# EAGLE design WM8731_STM32F405_Featherwing (EAGLE 9.6.2)
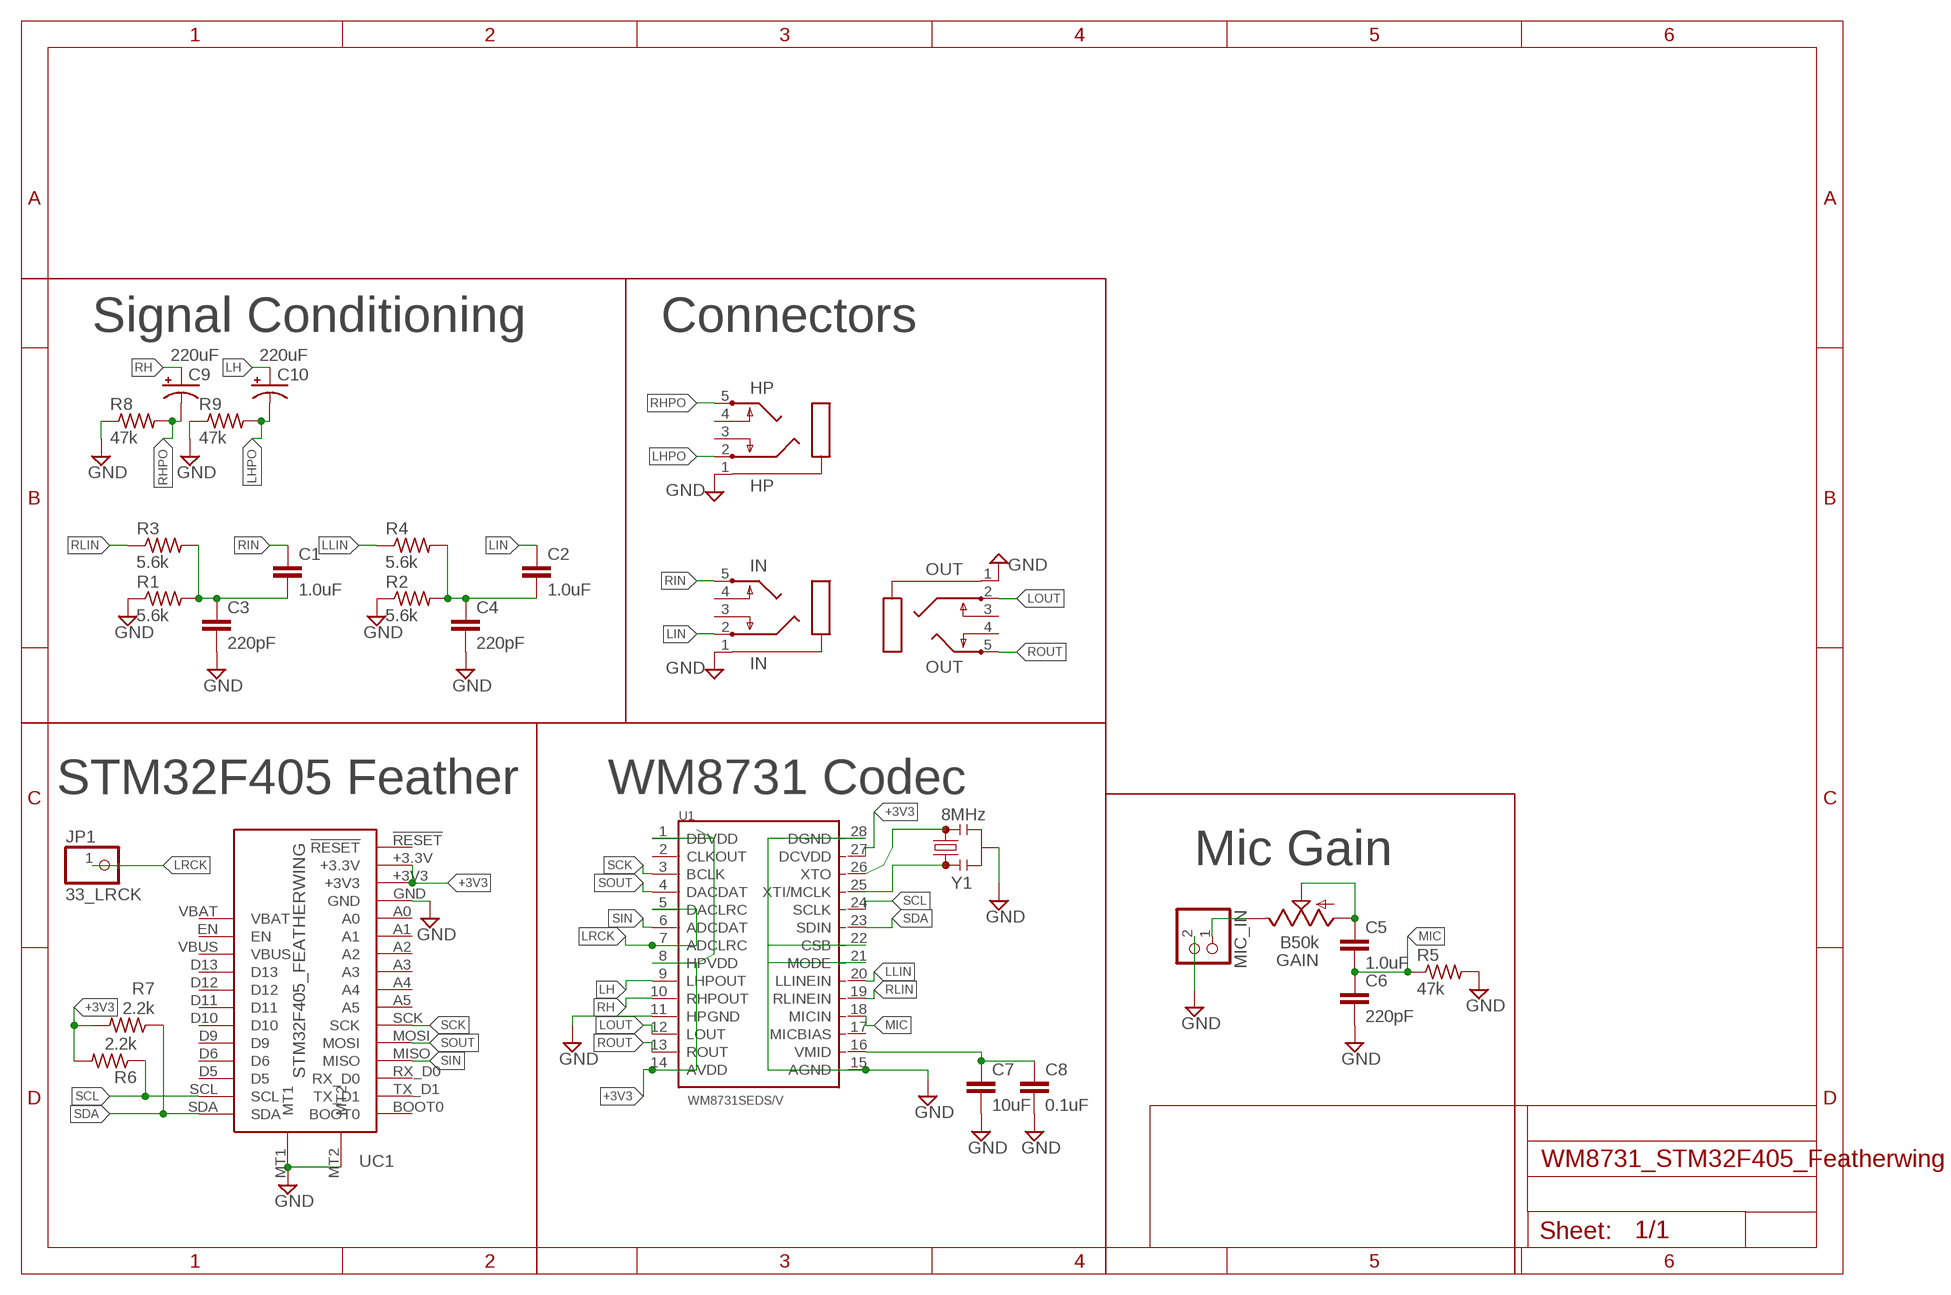
[diagram p0: schematic, sheet 1]

## Parts
C1  1.0uF  1.0UF-0402-16V-10%  [0402]
C2  1.0uF  1.0UF-0402-16V-10%  [0402]
C3  220pF  1.0UF-0402-16V-10%  [0402]
C4  220pF  1.0UF-0402-16V-10%  [0402]
C5  1.0uF  1.0UF-0402-16V-10%  [0402]
C6  220pF  1.0UF-0402-16V-10%  [0402]
C7  10uF  10UF-0603-6.3V-20%  [0603]
C8  0.1uF  0.1UF-0402-16V-10%  [0402]
C9  220uF  100UF-POLAR-25V-20%(ELEC)  [PANASONIC_D]
C10  220uF  100UF-POLAR-25V-20%(ELEC)  [PANASONIC_D]
GAIN  B50k  9MM_SNAP-IN_POT_  [9MM_SNAP-IN_POT]
HP  HP  STEREOJACK  [STX3100]
IN  IN  STEREOJACK  [STX3100]
JP1  33_LRCK  PINHD-1X1  [1X01]
MIC_IN  PINHD-1X2  [1X02]
OUT  OUT  STEREOJACK  [STX3100]
R1  5.6k  R-US_R0402  [R0402]
R2  5.6k  R-US_R0402  [R0402]
R3  5.6k  R-US_R0402  [R0402]
R4  5.6k  R-US_R0402  [R0402]
R5  47k  R-US_R0402  [R0402]
R6  2.2k  R-US_R0402  [R0402]
R7  2.2k  R-US_R0402  [R0402]
R8  47k  R-US_R0402  [R0402]
R9  47k  R-US_R0402  [R0402]
U1  WM8731SEDS/V  CODECODER-WM8731SEDS/V(SSOP28)  [SSOP28-0.65-10.2X5.2MM]
UC1  STM32F405_FEATHERWING  [STM32F405_FEATHERWING]
Y1  8MHz  RESONATOR-8MHZSMD_3.2X1.3  [RESONATOR-SMD-3.2X1.3]

## Nets
+3V3: R6.2 R7.2 U1.1(DBVDD) U1.8(HPVDD) U1.14(AVDD) U1.27(DCVDD) UC1.+3.3V UC1.+3V3
GND: C3.2 C4.2 C6.2 C7.2 C8.2 HP.1 IN.1 MIC_IN.2 OUT.1 R1.1 R2.1 R5.2 R8.1 R9.1 U1.11(HPGND) U1.15(AGND) U1.21(MODE) U1.22(CSB) U1.28(DGND) UC1.GND UC1.MT1 UC1.MT2 Y1.2
LH: C10.+ U1.9(LHPOUT)
LHPO: C10.- HP.2 R9.2
LIN: C2.1 IN.2
LLIN: R4.1 U1.20(LLINEIN)
LOUT: OUT.2 U1.12(LOUT)
LRCK: JP1.1 U1.5(DACLRC) U1.7(ADCLRC)
MIC: C5.2 C6.1 R5.1 U1.18(MICIN)
N$1: U1.25(XTI/MCLK) Y1.1
N$2: U1.26(XTO) Y1.3
N$3: C2.2 C4.1 R2.2 R4.2
N$4: C1.2 C3.1 R1.2 R3.2
N$5: C5.1 GAIN.1(A) GAIN.2(S)
N$6: C7.1 C8.1 U1.16(VMID)
N$8: GAIN.3(E) MIC_IN.1
RH: C9.+ U1.10(RHPOUT)
RHPO: C9.- HP.5 R8.2
RIN: C1.1 IN.5
RLIN: R3.1 U1.19(RLINEIN)
ROUT: OUT.5 U1.13(ROUT)
SCK: U1.3(BCLK) UC1.SCK
SCL: R6.1 U1.24(SCLK) UC1.SCL
SDA: R7.1 U1.23(SDIN) UC1.SDA
SIN: U1.6(ADCDAT) UC1.MISO
SOUT: U1.4(DACDAT) UC1.MOSI
Unconnected: HP.3 HP.4 IN.3 IN.4 OUT.3 OUT.4 U1.2(CLKOUT) U1.17(MICBIAS) UC1.!RESET! UC1.A0 UC1.A1 UC1.A2 UC1.A3 UC1.A4 UC1.A5 UC1.BOOT0 UC1.D5 UC1.D6 UC1.D9 UC1.D10 UC1.D11 UC1.D12 UC1.D13 UC1.EN UC1.RX_D0 UC1.TX_D1 UC1.VBAT UC1.VBUS

## Notes on the sheet
- Signal Conditioning | Connectors
- STM32F405 Feather | WM8731 Codec
- Mic Gain

## Library data of the parts
C1 C2 C5 = SparkFun-Capacitors:1.0UF: 1µF ceramic capacitors A capacitor is a passive two-terminal electrical component used to store electrical energy temporarily in an electric field.; PROD_ID: CAP-12417
C3 C4 C6 = SparkFun-Capacitors:1.0UF: 1µF ceramic capacitors A capacitor is a passive two-terminal electrical component used to store electrical energy temporarily in an electric field.; PROD_ID: CAP-12417; VALUE: 1.0uF
C7 = SparkFun-Capacitors:10UF: 10.0µF ceramic capacitors A capacitor is a passive two-terminal electrical component used to store electrical energy temporarily in an electric field.; PROD_ID: CAP-11015
C8 = SparkFun-Capacitors:0.1UF: 0.1µF ceramic capacitors A capacitor is a passive two-terminal electrical component used to store electrical energy temporarily in an electric field.; PROD_ID: CAP-12416
C9 C10 = SparkFun-Capacitors:100UF-POLAR: 100µF polarized capacitors A capacitor is a passive two-terminal electrical component used to store electrical energy temporarily in an electric field.; PROD_ID: CAP-12547; VALUE: 100uF
GAIN = MusicThingModular:9MM_SNAP-IN_POT: 9mm vertical snap-in pot, Alpha / Panasonic style
HP IN OUT = adafruit:STEREOJACK: MIC/HEADPHONE JACK Stereo jack with two switches. Kycon STX3100, CUI SJ1-3555NG and/or 4UCon 05544
JP1 = pinhead:PINHD-1X1: PIN HEADER
MIC_IN = pinhead:PINHD-1X2: PIN HEADER
R1-R9 = adafruit:R-US_: RESISTOR, American symbol
U1 = CODECODER-WM8731SEDS_V_SSOP28_:CODECODER-WM8731SEDS/V(SSOP28): 310080003 Check prices <https://pricing.snapeda.com/search/part/WM8731SEDS/V/?ref=eda>; AVAILABILITY: Warning; DESCRIPTION: Audio Interface 24 b Serial 28-SSOP; MF: Cirrus Logic; MP: WM8731SEDS/V; PACKAGE: SSOP-28 Cirrus Logic; PRICE: None; PURCHASE-URL: https://pricing.snapeda.com/search/part/WM8731SEDS/V/?ref=eda
UC1 = microbuilder:STM32F405_FEATHERWING
Y1 = SparkFun-Clocks:RESONATOR-8MHZ: 8MHz Resonator Digikey Example <http://www.digikey.com/product-detail/en/murata-electronics-north-america/CSTCE10M0G55-R0/490-1196-1-ND/584633> Frequency: 8MHz Frequency Stability: ±0.2% Frequency Tolerance: ±0.5% Capacitance: 33pF SparkFun Products Arduino Pro Mini 328- 3.3V/8MHz <https://www.sparkfun.com/products/11114> SparkFun Digital Sandbox <https://www.sparkfun.com/products/12651>; PROD_ID: XTAL-08895

## Board
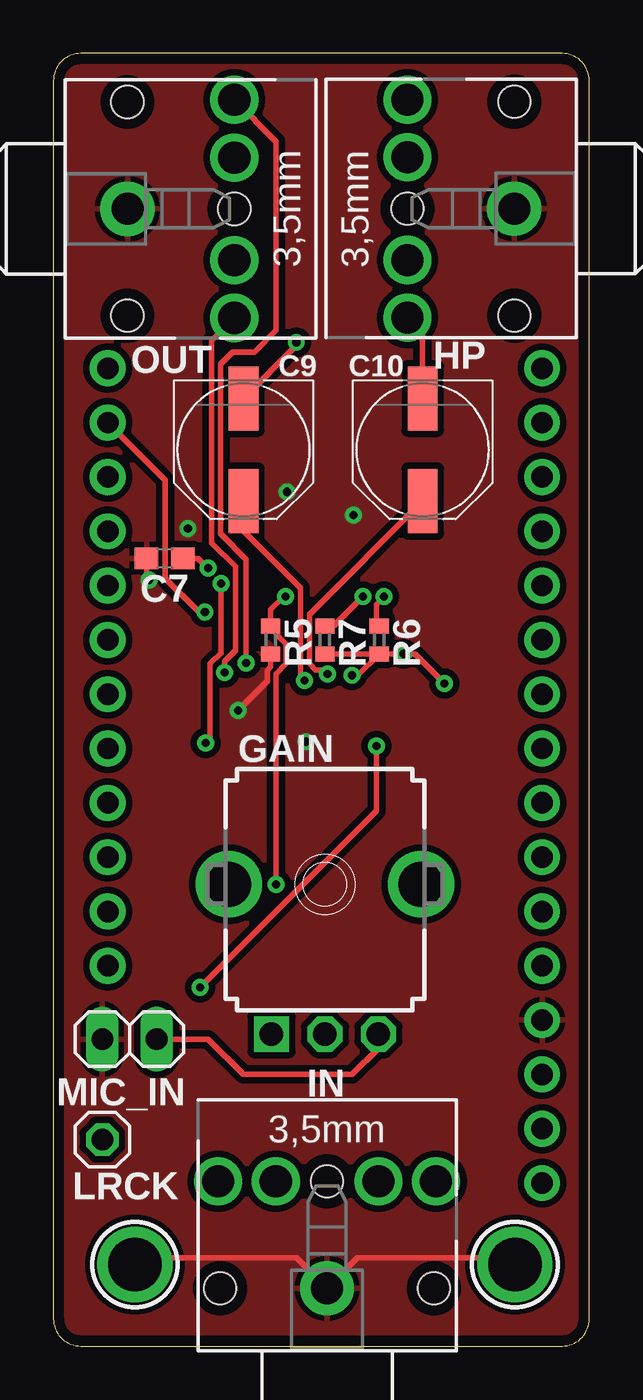
[diagram p1: board, top side]
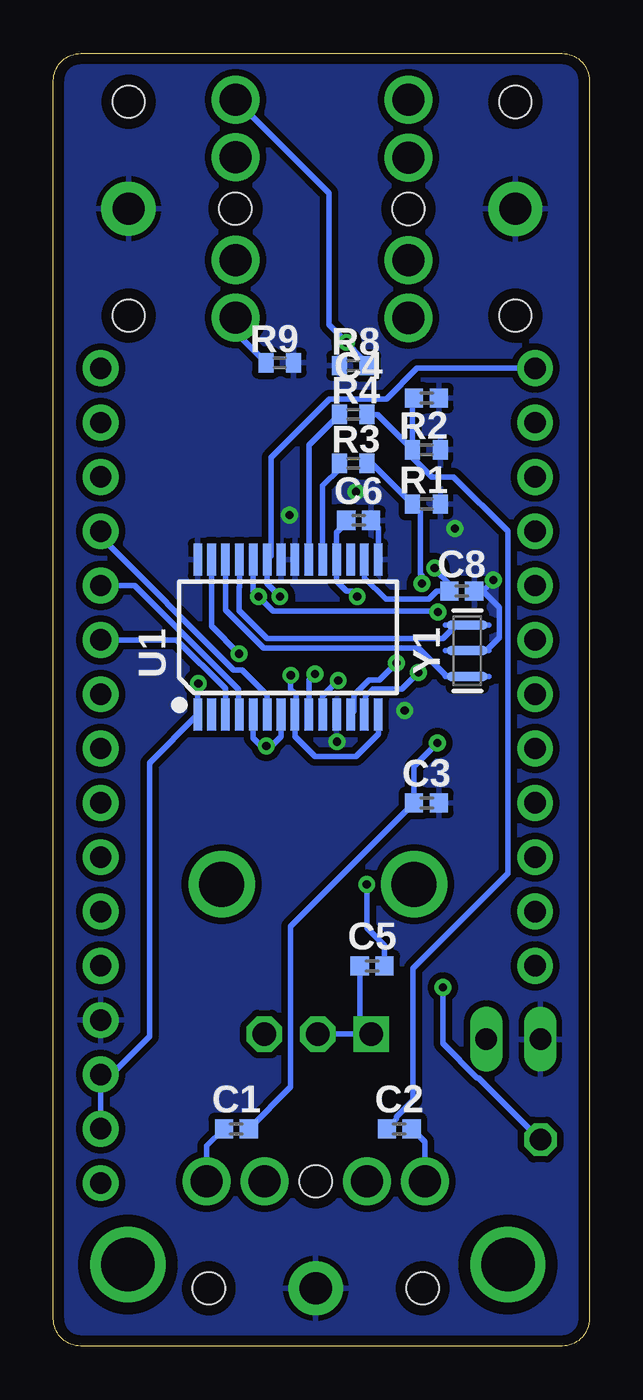
[diagram p2: board, bottom side, seen from below]

Size 25.07 x 60.44 mm. Coordinates in mm from the lower left corner, seen from the top.
Outline: 0,59.17 0,1.27 arc90 1.27,0 23.8,0 arc90 25.07,1.27 25.07,59.17 arc90 23.8,60.44 1.27,60.44 arc90 0,59.17
Copper layers (1*16): Top 0.035mm / dielectric 1.5mm / Bottom 0.035mm
Design rules "default *": minimum track width 6mil, minimum drill 0.35mm, track to track 6mil, track to pad 6mil, pad to pad 6mil, via to via 6mil, smd to smd 6mil, copper to edge 20mil, drill to drill 6mil, minimum pad ring 10mil, minimum via ring 8mil, stop-mask expansion 4mil, vias tented up to drill 0mil, thermal gap 10mil

### Footprints (pad centres in the part's own frame; a part is rotated, then mirrored left to right if it is on the bottom)
0402 = smd 0.85 x 0.9: 1 -0.58,0; 2 0.58,0
0603 = smd 1.1 x 1: 1 -0.85,0; 2 0.85,0
PANASONIC_D = smd 3 x 1.4: + 2.4,0; - -2.4,0
9MM_SNAP-IN_POT = drill 1.1 square: 1 -2.5,-7 | drill 1.1 octagon: 2 0,-7; 3 2.5,-7 | drill 2.1 pad 2.794: CHASSIS1 -4.5,0; CHASSIS2 4.5,0
STX3100 = drill 1.5 pad 2.54: 1 2.7,-0.1 | drill 1.5: 2 7.7,5; 3 7.7,2.3; 4 7.7,-2.5; 5 7.7,-5.2 | hole 1.5: 2.7,4.9; 2.7,-5.1; 7.7,-0.1
1X01 = drill 1.016 octagon: 1 0,0
1X02 = drill 1.016 long: 1 -1.27,0; 2 1.27,0
R0402 = smd 0.7 x 0.9: 1 -0.65,0; 2 0.65,0
SSOP28-0.65-10.2X5.2MM = smd 0.4 x 1.5: 1 -4.225,-3.625; 2 -3.575,-3.625; 3 -2.925,-3.625; 4 -2.275,-3.625; 5 -1.625,-3.625; 6 -0.975,-3.625; 7 -0.325,-3.625; 8 0.325,-3.625; 9 0.975,-3.625; 10 1.625,-3.625; 11 2.275,-3.625; 12 2.925,-3.625; 13 3.575,-3.625; 14 4.225,-3.625; 15 4.225,3.625; 16 3.575,3.625; 17 2.925,3.625; 18 2.275,3.625; 19 1.625,3.625; 20 0.975,3.625; 21 0.325,3.625; 22 -0.325,3.625; 23 -0.975,3.625; 24 -1.625,3.625; 25 -2.275,3.625; 26 -2.925,3.625; 27 -3.575,3.625; 28 -4.225,3.625
STM32F405_FEATHERWING = drill 1 pad 1.676: !RESET! 6.35,1.27; +3.3V 8.89,1.27; +3V3 11.43,1.27; A0 16.51,1.27; A1 19.05,1.27; A2 21.59,1.27; A3 24.13,1.27; A4 26.67,1.27; A5 29.21,1.27; BOOT0 44.45,1.27; D5 39.37,21.59; D6 36.83,21.59; D9 34.29,21.59; D10 31.75,21.59; D11 29.21,21.59; D12 26.67,21.59; D13 24.13,21.59; EN 19.05,21.59; GND 13.97,1.27; MISO 36.83,1.27; MOSI 34.29,1.27; RX_D0 39.37,1.27; SCK 31.75,1.27; SCL 41.91,21.59; SDA 44.45,21.59; TX_D1 41.91,1.27; VBAT 16.51,21.59; VBUS 21.59,21.59 | drill 2.5 pad 3.2: MT1 2.54,2.54; MT2 2.54,20.32
RESONATOR-SMD-3.2X1.3 = smd 0.45 x 1.905: 1 -1.2,0; 2 0,0; 3 1.2,0

### Placement (x,y rotation side)
C1  16.51,10.16 0 bottom
C2  8.89,10.16 180 bottom
C3  7.62,25.4 0 bottom
C4  7.62,44.32 0 bottom
C5  10.16,17.78 0 bottom
C6  10.79,38.61 0 bottom
C7  5.21,36.83 180 top
C8  5.97,35.31 0 bottom
C9  8.89,41.91 270 top
C10  17.27,41.91 270 top
GAIN  12.7,21.59 0 top
HP  24.26,53.09 180 top
IN  12.7,0 90 top
JP1  2.29,9.65 0 top
MIC_IN  3.56,14.35 180 top
OUT  0.76,53.28 0 top
R1  7.62,39.37 180 bottom
R2  7.62,41.91 180 bottom
R3  11.05,41.27 0 bottom
R4  11.05,43.56 0 bottom
R5  10.16,33.02 270 top
R6  15.24,33.02 270 top
R7  12.7,33.02 270 top
R8  11.05,45.85 0 bottom
R9  14.48,45.97 180 bottom
U1  14.1,33.15 0 bottom
UC1  24.13,1.27 90 top
Y1  5.71,32.51 270 bottom

### Tracks (layer width: path | path; a pad name or v marks a point on that pad's centre or on a via)
+3V3  (via drill 0.38)
  Top 0.254: R7.2 R6.2 | R6.2 14.24,31.37 v13.97,31.37 | v18.29,30.99 16.91,32.37 v16.38,32.37 R6.2
  Bottom 0.254: UC1.+3.3V UC1.+3V3 22.35,12.7 20.57,14.48 20.57,27.27 U1.1 18.32,30.95 v18.29,30.99 | v13.97,31.37 13.97,30.73 13.72,30.48 13.72,29.58 U1.8 13.77,28.5 12.83,27.56 10.92,27.56 9.87,28.61 U1.14 | U1.27 17.67,33.66 v16.38,32.37
GND  (via drill 0.38)
  Top 0.254: UC1.MT1 21.27,4.13 14.23,4.13 IN.1 11.37,4.13 4.13,4.13 UC1.MT2 | v4.48,35.81 4.36,35.94 C7.2 | R5.2 10.16,31.75 10.01,31.6 10.01,31.09 v8.64,29.72
  Bottom 0.254: Y1.2 4.83,32.51 4.22,33.12 4.22,34.54 4.98,35.31 C8.2 4.99,35.31 v4.48,35.81 | C6.2 9.87,38.27 U1.15
  other vias: 11.81,28.26 14.03,38.86 10.92,39.94 6.29,38.23
  pour Bottom (isolate 0.305): 0,-0.25 25.65,-0.25 25.65,60.45 25.15,60.96 0.25,60.96 -0.25,60.45 -0.25,0
  pour Top (isolate 0.305): -0.25,-0.25 25.15,-0.25 25.4,0 25.4,60.71 0,60.71 -0.25,60.45 -0.25,58.93
LH  (via drill 0.38)
  Top 0.254: v12.83,31.43 12.65,31.61 12.26,31.61 11.97,31.9 11.97,34.21 C10.+
  Bottom 0.254: U1.9 13.12,31.14 v12.83,31.43
LHPO
  Top 0.254: C10.- 17.27,47.37 HP.2
  Bottom 0.254: R9.2 16.56,47.4 HP.2
LIN
  Bottom 0.254: IN.2 7.7,9.55 C2.1
LLIN
  Bottom 0.254: U1.20 13.12,42.14 R4.1
LOUT  (via drill 0.38)
  Top 0.254: v9.02,31.94 9.02,36.79 7.81,37.99 7.81,45.91 8.38,46.48 9.4,46.48 10.41,47.5 10.41,56.33 OUT.2
  Bottom 0.254: U1.12 11,29.69 11,30.44 10.3,31.14 9.82,31.14 v9.02,31.94
LRCK  (via drill 0.38)
  Top 0.254: v6.86,16.76 15.11,25.02 v15.11,28.07
  Bottom 0.254: U1.7 14.42,28.5 14.86,28.07 v15.11,28.07 15.37,28.07 15.72,28.42 U1.5 | JP1.1 5.18,12.55 5.26,12.55 6.86,14.15 v6.86,16.76
MIC  (via drill 0.38)
  Top 0.254: v10.86,35.05 10.78,35.05 10.16,34.43 R5.1 10.16,33.56 10.89,32.84 10.89,31.9 10.41,31.43 v10.41,21.59
  Bottom 0.254: C6.1 11.38,38.49 11.82,38.04 U1.18 11.82,35.76 11.37,35.31 11.11,35.31 v10.86,35.05 | v10.41,21.59 10.41,19.56 9.58,18.72 C5.2
N$1
  Bottom 0.254: Y1.1 6.22,33.71 6.86,33.08 15.08,33.08 16.39,34.39 16.39,35.46 16.37,35.48 U1.25
N$2
  Bottom 0.254: Y1.3 6.67,31.31 8,32.64 15.24,32.64 17.02,34.42 U1.26
N$3
  Bottom 0.254: C4.1 8.27,44.25 R2.2 8.33,41.97 | 8.33,41.97 9.92,43.56 R4.2 | C2.2 9.01,10.62 9.01,10.73 8.26,11.48 8.26,17.65 3.81,22.1 3.81,38.1 6.35,40.64 7.37,40.64 8.33,41.6 8.33,41.97
N$4  (via drill 0.38)
  Top 0.254: v7.84,35.65 7.84,32.41 7.33,31.91 7.33,28.41 v7.11,28.19
  Bottom 0.254: R3.2 10.18,41.27 R1.2 7.91,39.01 7.91,36.11 7.84,36.03 v7.84,35.65 | C1.2 13.97,12.12 13.97,19.63 C3.1 8.2,27.11 v7.11,28.19
N$5
  Bottom 0.254: C5.1 10.74,15.13 GAIN.1 GAIN.2
N$6  (via drill 0.38)
  Top 0.254: v7.24,36.39 7.2,36.39 6.75,36.83 C7.1
  Bottom 0.254: U1.16 10.52,35.92 9.53,34.92 7.5,34.92 7.12,35.31 C8.1 6.55,35.62 7.24,36.31 v7.24,36.39
N$8
  Top 0.254: MIC_IN.1 7.24,14.35 8.89,12.7 13.97,12.7 15.2,13.93 GAIN.3
RH  (via drill 0.38)
  Top 0.254: v11.75,31.11 11.56,31.3 11.56,35.43 8.89,38.1 C9.+
  Bottom 0.254: U1.10 12.47,30.39 v11.75,31.11
RHPO  (via drill 0.38)
  Top 0.254: C9.- 11.36,46.78 v11.36,46.93
  Bottom 0.254: R8.2 10.65,46.1 10.65,46.23 v11.36,46.93 12.18,47.75 12.18,53.91 HP.5
RIN
  Bottom 0.254: IN.5 17.9,9.35 C1.1
RLIN
  Bottom 0.254: U1.19 12.47,40.23 11.7,41.01 R3.1
ROUT  (via drill 0.38)
  Top 0.254: v8,31.5 8,32 8.51,32.51 8.51,34.8 8.51,36.45 7.4,37.55 7.4,47.02 OUT.5
  Bottom 0.254: U1.13 10.48,29.57 10.48,30.39 10.13,30.73 8.76,30.73 v8,31.5
SCK
  Bottom 0.254: U1.3 17.02,30.74 19.3,33.02 UC1.SCK
SCL  (via drill 0.38)
  Top 0.254: v15.47,35.05 15.1,34.68 15.1,33.81 R6.1 | UC1.SCL 5.23,40.49 5.23,35.9 6.8,34.32 v7.08,34.32
  Bottom 0.254: U1.24 15.72,35.31 v15.47,35.05 14.79,34.38 7.14,34.38 v7.08,34.32
SDA  (via drill 0.38)
  Top 0.254: v14.48,35.05 13.1,33.67 R7.1
  Bottom 0.254: v14.48,35.05 15.07,35.65 U1.23 14.9,36.94 14.9,41.55 12.16,44.29 9.5,44.29 8.07,45.72 UC1.SDA
SIN
  Bottom 0.254: UC1.MISO 22.86,37.85 16.64,31.62 16.26,31.62 15.07,30.44 U1.6
SOUT
  Bottom 0.254: U1.4 16.42,29.57 16.42,30.71 21.27,35.56 UC1.MOSI

### Text on the board
tPlace: LRCK